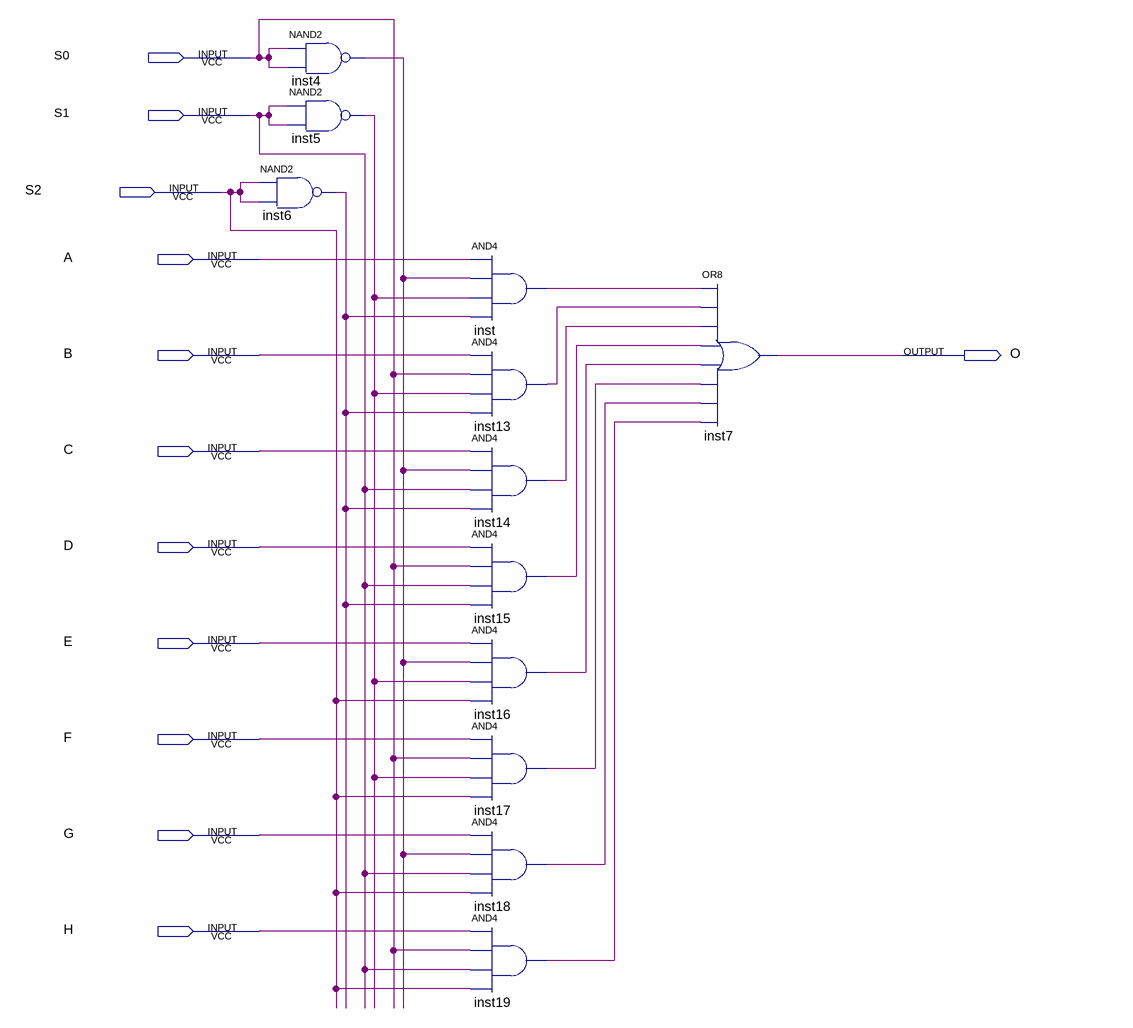
[diagram p0: schematic sheet]
// Quartus schematic multiplexer_1b_8w.bdf as structural Verilog: 12 symbols, 12 pins
module multiplexer_1b_8w (
  input  S0,
  input  S1,
  input  S2,
  input  A,
  input  B,
  input  C,
  input  D,
  input  E,
  input  F,
  input  G,
  input  H,
  output O
);

  wire inst4_out, inst5_out, inst6_out, inst13_out, inst14_out, inst15_out, inst16_out, inst17_out,
       inst18_out, inst19_out, inst_out;

  nand inst4 (inst4_out, S0, S0);
  nand inst5 (inst5_out, S1, S1);
  nand inst6 (inst6_out, S2, S2);
  and inst (inst_out, A, inst4_out, inst5_out, inst6_out);
  and inst13 (inst13_out, B, S0, inst5_out, inst6_out);
  and inst14 (inst14_out, C, inst4_out, S1, inst6_out);
  and inst15 (inst15_out, D, S0, S1, inst6_out);
  and inst16 (inst16_out, E, inst4_out, inst5_out, S2);
  and inst17 (inst17_out, F, S0, inst5_out, S2);
  and inst18 (inst18_out, G, inst4_out, S1, S2);
  and inst19 (inst19_out, H, S0, S1, S2);
  or inst7 (O, inst_out, inst13_out, inst14_out, inst15_out, inst16_out, inst17_out, inst18_out, inst19_out);
endmodule
